# EAGLE design communication (EAGLE 6.5.0)
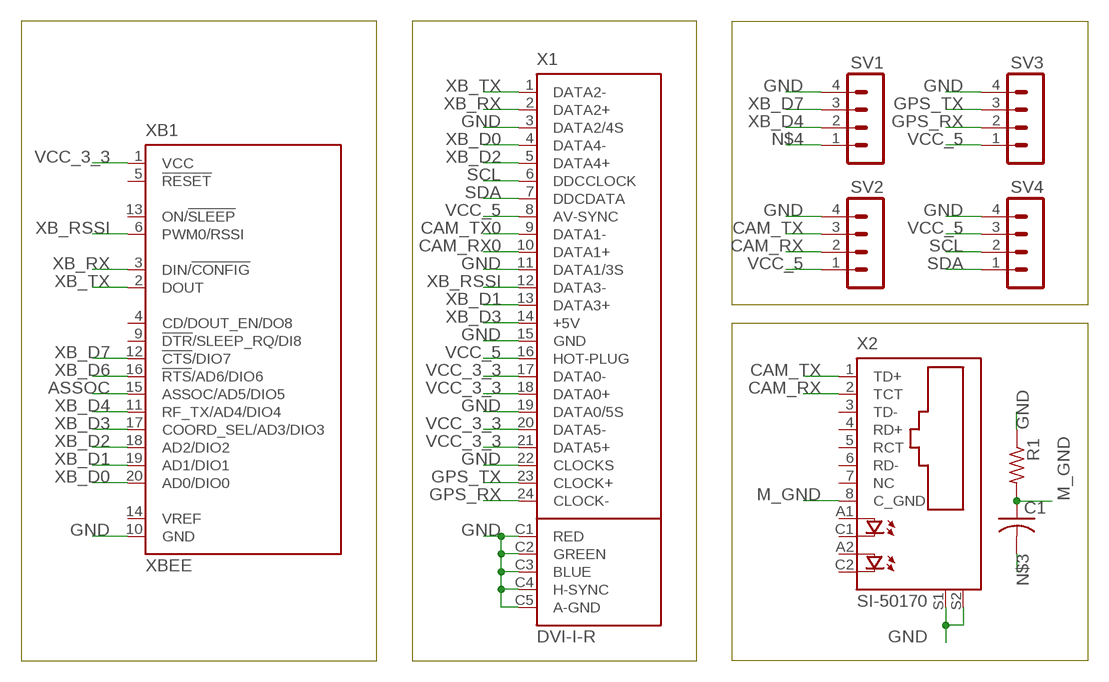
[diagram p0: schematic, sheet 1]

## Parts
C1  C-US025-024X044  [C025-024X044]
R1  R-US_0204/2V  [0204V]
SV1  MA04-1  [MA04-1]
SV2  MA04-1  [MA04-1]
SV3  MA04-1  [MA04-1]
SV4  MA04-1  [MA04-1]
X1  DVI-I-R  [DVI-I-R]
X2  SI-50170  [SI-50170]
XB1  XBEE  [XBEE]

## Nets
ASSOC: XB1.15(ASSOC/AD5/DIO5)
CAM_RX: SV2.2 X2.2(TCT)
CAM_RX0: X1.10(DATA1+)
CAM_TX: SV2.3 X2.1(TD+)
CAM_TX0: X1.9(DATA1-)
GND: R1.1 SV1.4 SV2.4 SV3.4 SV4.4 X1.3(DATA2/4S) X1.11(DATA1/3S) X1.15(GND) X1.19(DATA0/5S) X1.22(CLOCKS) X1.C1(RED) X1.C2(GREEN) X1.C3(BLUE) X1.C4(H-SYNC) X1.C5(A-GND) X2.S1 X2.S2 XB1.10(GND)
GPS_RX: SV3.2 X1.24(CLOCK-)
GPS_TX: SV3.3 X1.23(CLOCK+)
M_GND: C1.1 R1.2 X2.8(C_GND)
N$3: C1.2
N$4: SV1.1
SCL: SV4.2 X1.6(DDCCLOCK)
SDA: SV4.1 X1.7(DDCDATA)
VCC_3_3: X1.17(DATA0-) X1.18(DATA0+) X1.20(DATA5-) X1.21(DATA5+) XB1.1(VCC)
VCC_5: SV2.1 SV3.1 SV4.3 X1.8(AV-SYNC) X1.16(HOT-PLUG)
XB_D0: X1.4(DATA4-) XB1.20(AD0/DIO0)
XB_D1: X1.13(DATA3+) XB1.19(AD1/DIO1)
XB_D2: X1.5(DATA4+) XB1.18(AD2/DIO2)
XB_D3: X1.14(+5V) XB1.17(COORD_SEL/AD3/DIO3)
XB_D4: SV1.2 XB1.11(RF_TX/AD4/DIO4)
XB_D6: XB1.16(!RTS!/AD6/DIO6)
XB_D7: SV1.3 XB1.12(!CTS!/DIO7)
XB_RSSI: X1.12(DATA3-) XB1.6(PWM0/RSSI)
XB_RX: X1.2(DATA2+) XB1.3(DIN/!CONFIG)
XB_TX: X1.1(DATA2-) XB1.2(DOUT)
Unconnected: X2.3(TD-) X2.4(RD+) X2.5(RCT) X2.6(RD-) X2.7(NC) X2.A1(A) X2.A2(A1) X2.C1(C) X2.C2(C1) XB1.4(CD/DOUT_EN/DO8) XB1.5(!RESET) XB1.9(!DTR!/SLEEP_RQ/DI8) XB1.13(ON/!SLEEP) XB1.14(VREF)

## Power pins joined to a net without a drawn wire
AGND: X1.C6(AGND)

## Library data of the parts
C1 = rcl:C-US: CAPACITOR, American symbol
R1 = resistor:R-US_: RESISTOR, American symbol
SV1-SV4 = con-lstb:MA04-1: PIN HEADER; OC_FARNELL: unknown; OC_NEWARK: unknown
X1 = con-molex:DVI-I-R: CONNECTOR MiroCross(TM)-DVI i/0 plug and receptacle connector system (scart); OC_FARNELL: unknown; OC_NEWARK: unknown
X2 = con-stewart:SI-50170: Ethernet Connector MagJack (R) Source: www.stewartconnector.com .. si-50170.pdf; OC_FARNELL: unknown; OC_NEWARK: unknown
XB1 = maxstream:XBEE: XBee (TM) /XBee-PRO(TM) OEM RF Modules Source: MaxStream, Inc. xbee_productmanual.pdf; MPN: XBP24-Z7UIT-004; OC_FARNELL: 1751799; OC_NEWARK: 34R5507

## Board
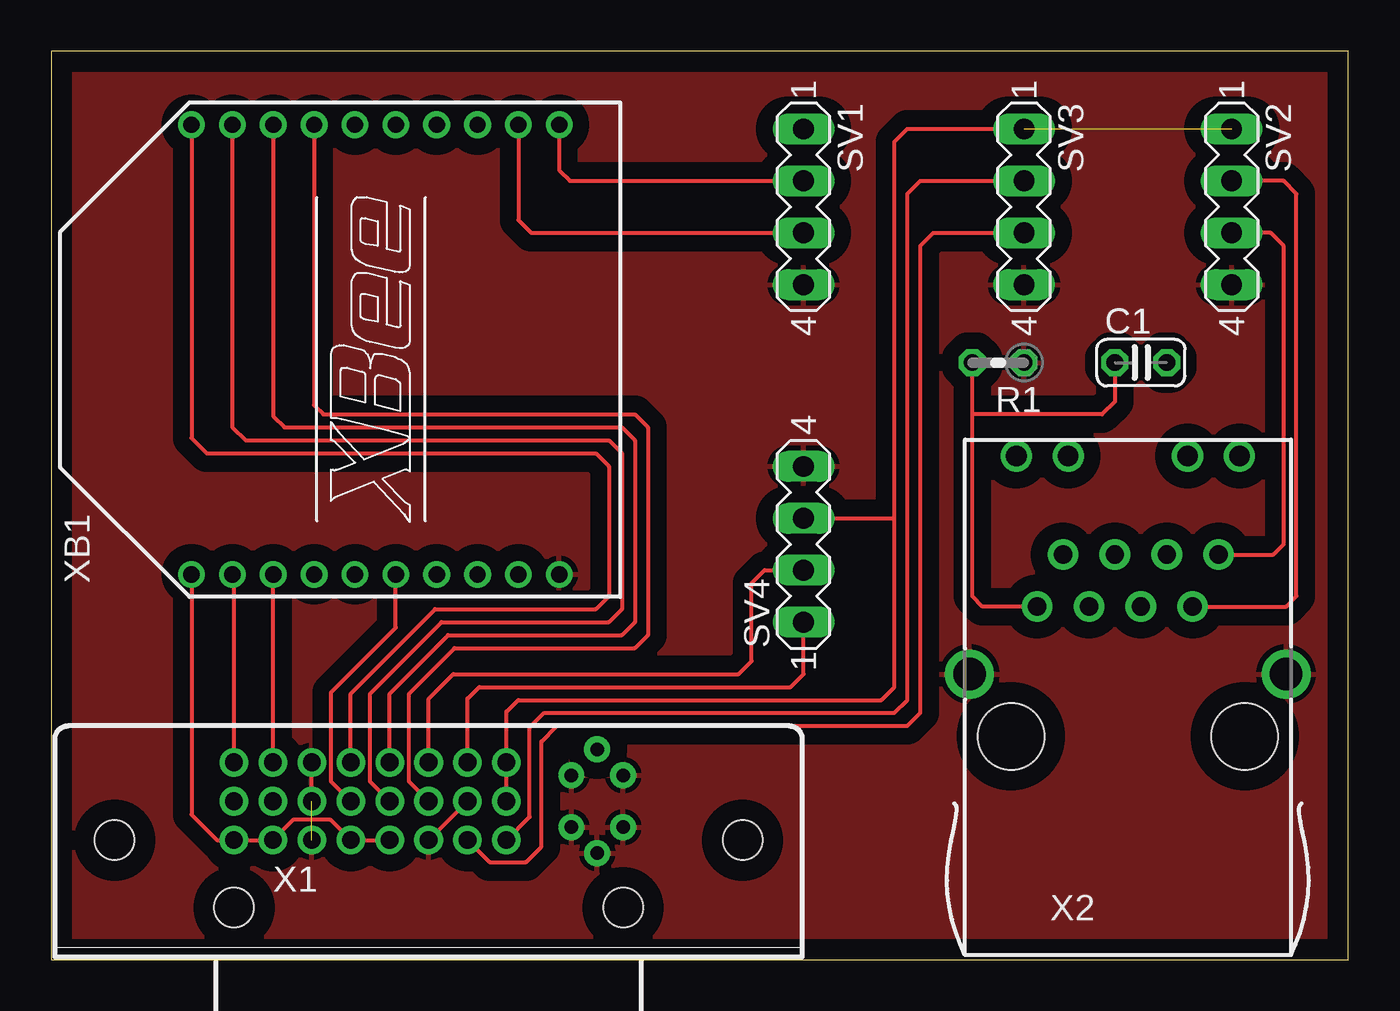
[diagram p1: board, top side]

Size 63.5 x 44.45 mm. Coordinates in mm from the lower left corner, seen from the top.
Outline: 0,0 63.5,0 63.5,44.45 0,44.44 0,0
Copper layers (1*16): Top 0.035mm / dielectric 1.5mm / Bottom 0.035mm
Design rules "default": minimum track width 10mil, minimum drill 24mil, track to track 8mil, track to pad 8mil, pad to pad 8mil, via to via 8mil, smd to smd 8mil, copper to edge 40mil, drill to drill 8mil, minimum pad ring 10mil, minimum via ring 8mil, stop-mask expansion 4mil, vias tented up to drill 0mil, thermal gap 10mil

### Footprints (pad centres in the part's own frame; a part is rotated, then mirrored left to right if it is on the bottom)
C025-024X044 = drill 0.813 octagon: 1 -1.27,0; 2 1.27,0
0204V = drill 0.813 octagon: 1 -1.27,0; 2 1.27,0
MA04-1 = drill 1.016 long: 1 -3.81,0; 2 -1.27,0; 3 1.27,0; 4 3.81,0
DVI-I-R = drill 0.864 pad 1.397: 1 -9.525,6.985; 2 -7.62,6.985; 3 -5.715,6.985; 4 -3.81,6.985; 5 -1.905,6.985; 6 0,6.985; 7 1.905,6.985; 8 3.81,6.985; 9 -9.525,5.08; 10 -7.62,5.08; 11 -5.715,5.08; 12 -3.81,5.08; 13 -1.905,5.08; 14 0,5.08; 15 1.905,5.08; 16 3.81,5.08; 17 -9.525,3.175; 18 -7.62,3.175; 19 -5.715,3.175; 20 -3.81,3.175; 21 -1.905,3.175; 22 0,3.175; 23 1.905,3.175; 24 3.81,3.175 | drill 0.66 pad 1.27: C1 6.985,6.35; C2 9.525,6.35; C3 6.985,3.81; C4 9.525,3.81; C5 8.255,2.54; C6 8.255,7.62 | hole 1.93: -15.367,3.175; 15.367,3.175; -9.525,-0.127; 9.525,-0.127
SI-50170 = drill 0.9 pad 1.5: 1 4.445,5.842; 2 3.175,3.302; 3 1.905,5.842; 4 0.635,3.302; 5 -0.635,5.842; 6 -1.905,3.302; 7 -3.175,5.842; 8 -4.445,3.302 | drill 1.016 pad 1.5: A1 -5.461,10.668; A2 2.921,10.668; C1 -2.921,10.668; C2 5.461,10.668 | drill 1.6 pad 2.2: S1 -7.747,0; S2 7.747,0 | hole 3.251: -5.715,-3.048; 5.715,-3.048
XBEE = drill 0.8 pad 1.27: 1 -11,9; 2 -11,7; 3 -11,5; 4 -11,3; 5 -11,1; 6 -11,-1; 7 -11,-3; 8 -11,-5; 9 -11,-7; 10 -11,-9; 11 11,-9; 12 11,-7; 13 11,-5; 14 11,-3; 15 11,-1; 16 11,1; 17 11,3; 18 11,5; 19 11,7; 20 11,9

### Placement (x,y rotation side)
C1  53.34,29.21 0 top
R1  46.35,29.21 180 top
SV1  36.83,36.83 270 top
SV2  57.78,36.83 270 top
SV3  47.62,36.83 270 top
SV4  36.83,20.32 90 top
X1  18.48,2.67 0 top
X2  52.7,13.97 0 top
XB1  15.88,29.84 90 top

### Tracks (layer width: path | path; a pad name or v marks a point on that pad's centre or on a via)
CAM_RX
  Top 0.203: X2.2 60.45,17.27 60.96,17.78 60.96,37.47 60.33,38.1 SV2.2
CAM_TX
  Top 0.203: X2.1 59.82,19.81 60.33,20.32 60.33,34.92 59.69,35.56 SV2.3
GND  (1 unrouted)
  Top 0.203: X1.11 X1.3 | X1.22 X1.15
  pour Top (isolate 0.813): 0,0 63.5,0 63.5,35.56 63.5,44.45 0,44.45
GPS_RX
  Top 0.203: X1.24 23.43,6.99 23.43,11.37 24.13,12.06 41.27,12.06 41.91,12.7 41.91,37.47 42.55,38.1 SV3.2
GPS_TX
  Top 0.203: X1.23 21.46,4.76 23.24,4.76 24,5.52 24,10.67 24.77,11.43 41.91,11.43 42.55,12.06 42.55,34.92 43.18,35.56 SV3.3
M_GND
  Top 0.203: X2.8 45.59,17.27 45.09,17.78 45.09,26.67 | 45.09,26.67 R1.2 | C1.1 52.07,27.3 51.44,26.67 45.09,26.67
SCL
  Top 0.203: X1.6 18.48,12.76 19.68,13.97 33.66,13.97 34.29,14.61 34.29,18.41 34.92,19.05 SV4.2
SDA
  Top 0.203: X1.7 20.38,12.76 20.95,13.34 36.2,13.34 36.83,13.97 SV4.1
VCC_3_3
  Top 0.203: XB1.1 6.88,7.09 8.13,5.84 X1.17 X1.18 11.87,6.86 13.65,6.86 X1.20 X1.21
VCC_5  (1 unrouted)
  Top 0.203: X1.16 X1.8 22.29,12.13 22.86,12.7 40.64,12.7 41.27,13.34 41.27,21.59 | SV3.1 41.91,40.64 41.27,40.01 41.27,21.59 | SV4.3 41.27,21.59
XB_D0
  Top 0.203: XB1.20 6.88,25.51 7.62,24.77 26.67,24.77 27.3,24.13 27.3,17.78 26.67,17.14 18.8,17.14 14.67,13.02 X1.4
XB_D1
  Top 0.203: XB1.19 8.88,26.05 9.53,25.4 27.3,25.4 27.94,24.77 27.94,17.14 27.3,16.51 19.11,16.51 15.62,13.02 15.62,8.7 X1.13
XB_D2
  Top 0.203: XB1.18 10.88,26.59 11.43,26.04 27.94,26.04 28.57,25.4 28.57,16.51 27.94,15.88 19.43,15.88 16.57,13.02 X1.5
XB_D3
  Top 0.203: XB1.17 12.88,27.13 13.34,26.67 28.57,26.67 29.21,26.04 29.21,15.88 28.57,15.24 19.75,15.24 17.53,13.02 17.53,8.7 X1.14
XB_D4
  Top 0.203: XB1.11 24.88,38.62 25.4,38.1 SV1.2
XB_D7
  Top 0.203: XB1.12 22.88,36.18 23.5,35.56 SV1.3
XB_RSSI
  Top 0.203: XB1.6 16.88,16.24 13.72,13.08 13.72,8.7 X1.12
XB_RX
  Top 0.203: X1.2 10.86,18.83 XB1.3
XB_TX
  Top 0.203: X1.1 8.95,18.77 XB1.2